# EAGLE schematic PowerBricksBoard1_X14 (EAGLE 9.6.2)
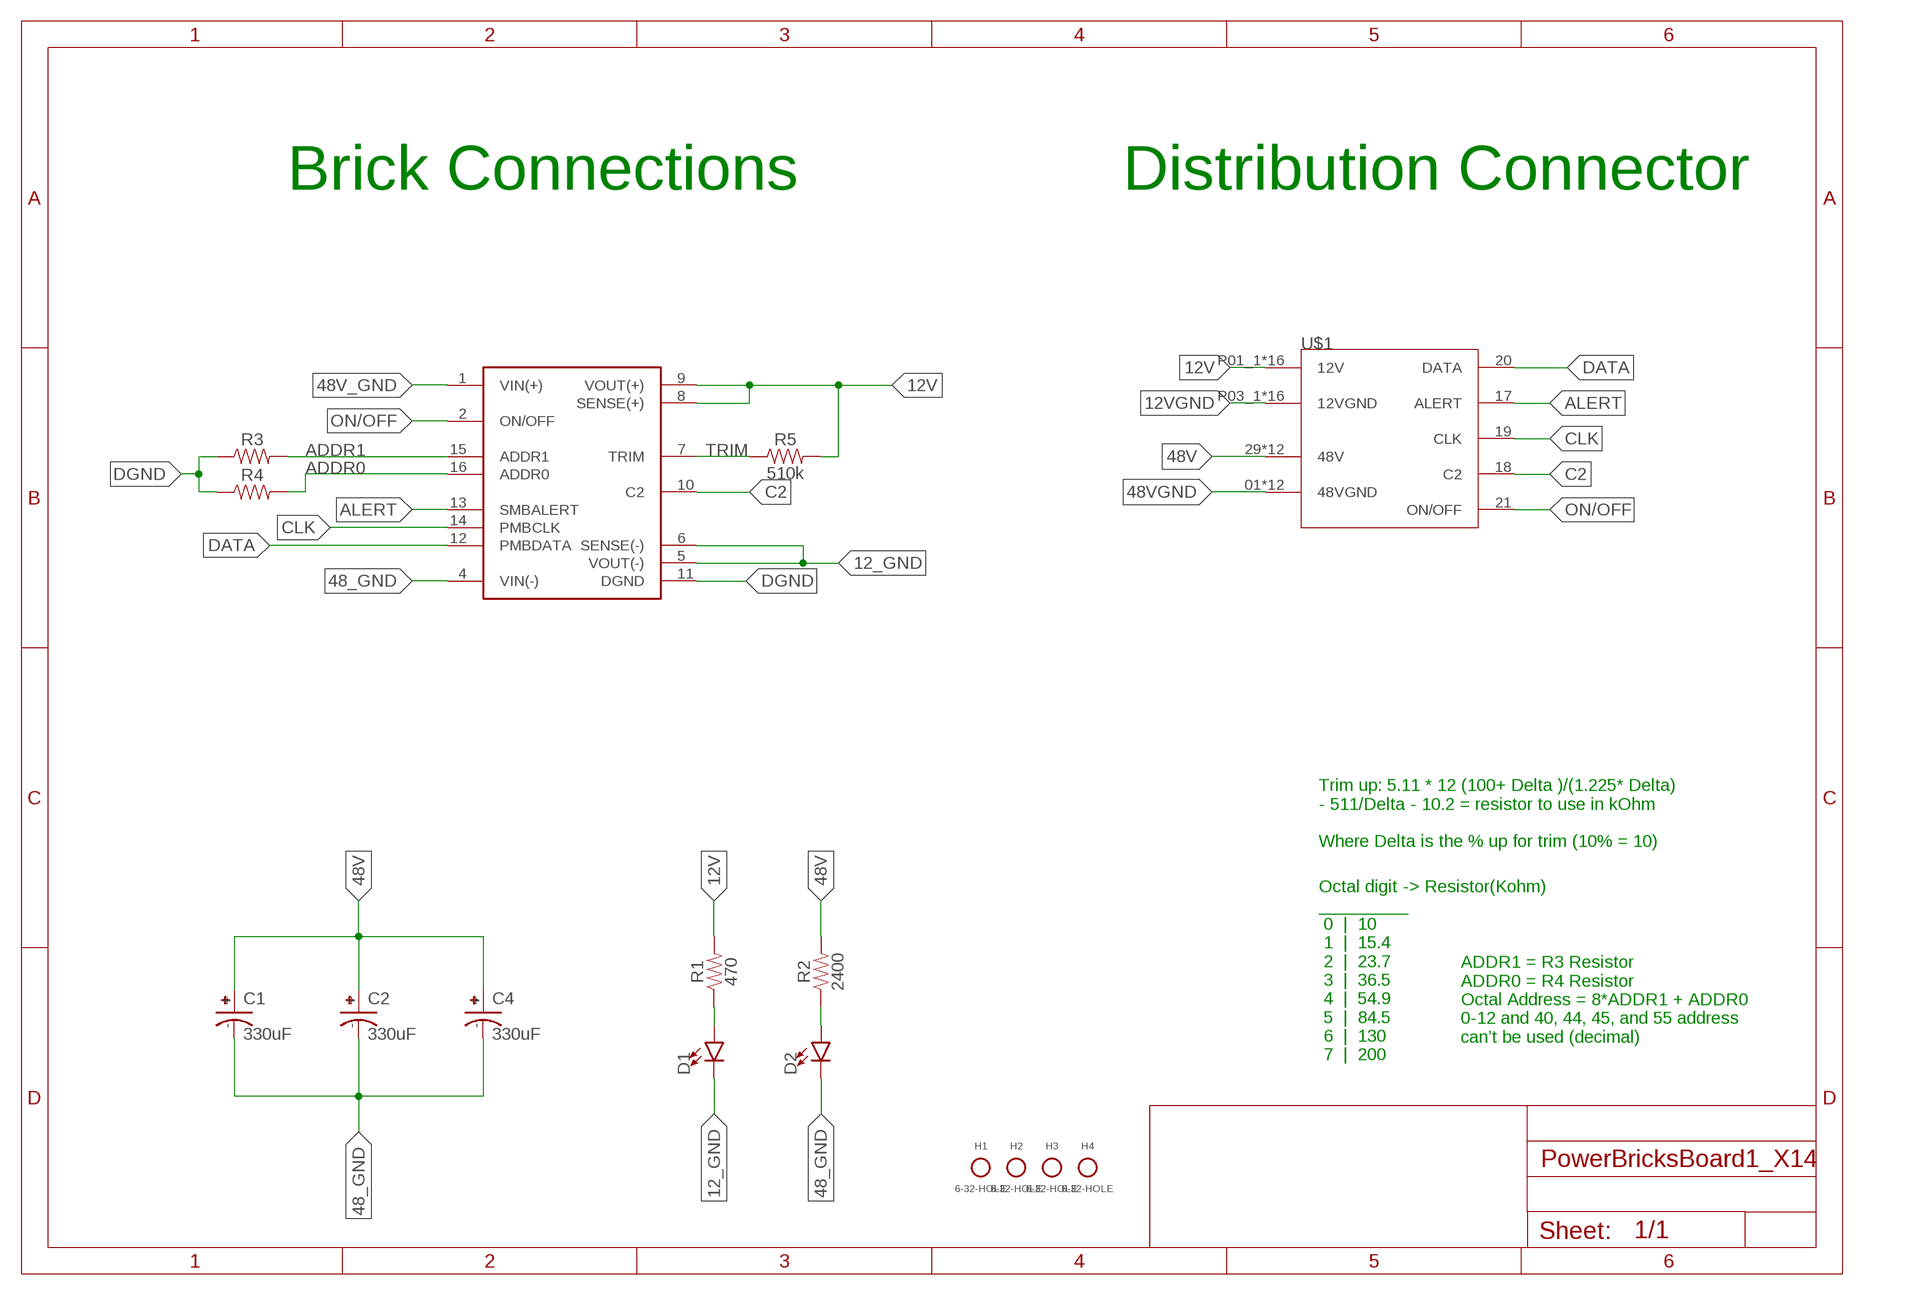
[diagram p0: schematic, sheet 1]

## Parts
C1  330uF  UCM1H331MNL1GS  [CAPAE1030X1050N]
C2  330uF  UCM1H331MNL1GS  [CAPAE1030X1050N]
C4  330uF  UCM1H331MNL1GS  [CAPAE1030X1050N]
D1  LED0603  [LED-0603]
D2  LED0603  [LED-0603]
H1  6-32-HOLE  [6-32-HOLE]
H2  6-32-HOLE  [6-32-HOLE]
H3  6-32-HOLE  [6-32-HOLE]
H4  6-32-HOLE  [6-32-HOLE]
R1  470  RESISTOR0603  [0603]
R2  2400  RESISTOR0603  [0603]
R3  RESISTOR0603  [0603]
R4  RESISTOR0603  [0603]
R5  510k  RESISTOR0603  [0603]
U$1  PETC-02-40-01-X-VT(BTOD)  [SAMTEC_PETC-02-40-01-X-VT_BTOD]
U$2  Q48SC12050NRDH  [Q48SC12050NRDH]

## Nets
12_GND: D1.C U$2.5(VOUT(-)) U$2.6(SENSE(-))
12V: R1.2 R5.2 U$1.P01_1(12V) U$1.P01_2(12V) U$1.P01_3(12V) U$1.P01_4(12V) U$1.P01_5(12V) U$1.P01_6(12V) U$1.P01_7(12V) U$1.P01_8(12V) U$1.P02_1(12V) U$1.P02_2(12V) U$1.P02_3(12V) U$1.P02_4(12V) U$1.P02_5(12V) U$1.P02_6(12V) U$1.P02_7(12V) U$1.P02_8(12V) U$2.8(SENSE(+)) U$2.9(VOUT(+))
12VGND: U$1.P03_1(12VGND) U$1.P03_2(12VGND) U$1.P03_3(12VGND) U$1.P03_4(12VGND) U$1.P03_5(12VGND) U$1.P03_6(12VGND) U$1.P03_7(12VGND) U$1.P03_8(12VGND) U$1.P04_1(12VGND) U$1.P04_2(12VGND) U$1.P04_3(12VGND) U$1.P04_4(12VGND) U$1.P04_5(12VGND) U$1.P04_6(12VGND) U$1.P04_7(12VGND) U$1.P04_8(12VGND)
48_GND: C1.- C2.- C4.- D2.C U$2.4(VIN(-))
48V: C1.+ C2.+ C4.+ R2.2 U$1.29(48V) U$1.30(48V) U$1.31(48V) U$1.32(48V) U$1.33(48V) U$1.34(48V) U$1.35(48V) U$1.36(48V) U$1.37(48V) U$1.38(48V) U$1.39(48V) U$1.40(48V)
48V_GND: U$2.1(VIN(+))
48VGND: U$1.01(48VGND) U$1.02(48VGND) U$1.03(48VGND) U$1.04(48VGND) U$1.05(48VGND) U$1.06(48VGND) U$1.07(48VGND) U$1.08(48VGND) U$1.09(48VGND) U$1.10(48VGND) U$1.11(48VGND) U$1.12(48VGND)
ADDR0: R4.2 U$2.16(ADDR0)
ADDR1: R3.2 U$2.15(ADDR1)
ALERT: U$1.17(ALERT) U$2.13(SMBALERT)
C2: U$1.18(C2) U$2.10(C2)
CLK: U$1.19(CLK) U$2.14(PMBCLK)
DATA: U$1.20(DATA) U$2.12(PMBDATA)
DGND: R3.1 R4.1 U$2.11(DGND)
N$1: D1.A R1.1
N$2: D2.A R2.1
ON/OFF: U$1.21(ON/OFF) U$2.2(ON/OFF)
TRIM: R5.1 U$2.7(TRIM)

## Notes on the sheet
- Brick Connections | Distribution Connector
- Trim up: 5.11 * 12 (100+ Delta )/(1.225* Delta) 
  - 511/Delta - 10.2 = resistor to use in kOhm
  
  Where Delta is the % up for trim (10% = 10)
- ADDR1 = R3 Resistor
  ADDR0 = R4 Resistor
  Octal Address = 8*ADDR1 + ADDR0 
  0-12 and 40, 44, 45, and 55 address 
  can’t be used (decimal)
- Octal digit -> Resistor(Kohm) 
  _________
   0  |  10 
   1  |  15.4 
   2  |  23.7 
   3  |  36.5 
   4  |  54.9 
   5  |  84.5 
   6  |  130 
   7  |  200

## Library data of the parts
C1 C2 C4 = brick-capacitor-UCM1H331MNL1GS:UCM1H331MNL1GS: Nichicon 330uF 50 V Aluminium Electrolytic Capacitor SMD, CM Series 2000h 10 (Dia.) x 10mm Source: Datasheet <http://www.nichicon.co.jp/english/products/pdfs/e-ucm.pdf>; ARROW_PART_NUMBER: UCM1H331MNL1GS; ARROW_PRICE-STOCK: https://www.arrow.com/en/products/ucm1h331mnl1gs/nichicon; DESCRIPTION: Nichicon 330uF 50 V Aluminium Electrolytic Capacitor SMD, CM Series 2000h 10 (Dia.) x 10mm; HEIGHT: 10.5mm; MANUFACTURER_NAME: Nichicon; MANUFACTURER_PART_NUMBER: UCM1H331MNL1GS; MOUSER_PART_NUMBER: 647-UCM1H331MNL1GS; MOUSER_PRICE-STOCK: https://www.mouser.co.uk/ProductDetail/Nichicon/UCM1H331MNL1GS?qs=DSgADHjnLTkTovFLdbC%252BNg%3D%3D
D1 D2 = SparkFun-LED:LED: LED (Generic) Standard schematic elements and footprints for 5mm, 3mm, 1206, and 0603 sized LEDs. Generic LEDs with no color specified.
H1-H4 = Mounting Holes:6-32-HOLE
R1-R5 = SparkFun-Resistors:RESISTOR: Generic Resistor Package
U$1 = CONN, Distribution-Bricks:PETC-02-40-01-X-VT(BTOD)
U$2 = Delta Power Bricks - Q48SC12050NRDH:Q48SC12050NRDH